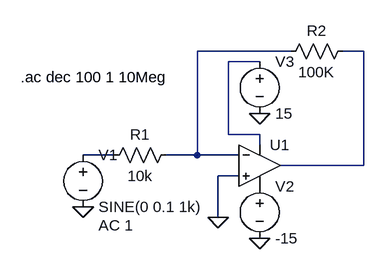
[diagram p0: schematic 00_inverting_amp_smoke_test.asc]
00_inverting_amp_smoke_test.asc, the LTspice schematic file:
Version 4.1
SHEET 1 880 680
WIRE 80 -112 -64 -112
WIRE 192 -112 160 -112
WIRE 32 -96 -16 -96
WIRE -16 16 -16 -96
WIRE 32 16 -16 16
WIRE 32 32 32 16
WIRE -192 48 -240 48
WIRE -64 48 -64 -112
WIRE -64 48 -112 48
WIRE 0 48 -64 48
WIRE 192 64 192 -112
WIRE 192 64 64 64
WIRE 0 80 -32 80
WIRE -32 144 -32 80
FLAG -32 144 0
FLAG -240 128 0
FLAG 32 176 0
FLAG 32 -16 0
SYMBOL OpAmps\\UniversalOpAmp2 32 64 R0
SYMATTR InstName U1
SYMBOL res -96 32 R90
WINDOW 0 0 56 VBottom 2
WINDOW 3 32 56 VTop 2
SYMATTR InstName R1
SYMATTR Value 10k
SYMBOL res 176 -128 R90
WINDOW 0 0 56 VBottom 2
WINDOW 3 32 56 VTop 2
SYMATTR InstName R2
SYMATTR Value 100K
SYMATTR SpiceLine tol=1 pwr=0.1
SYMBOL voltage -240 32 R0
WINDOW 123 24 124 Left 2
WINDOW 39 0 0 Left 0
SYMATTR InstName V1
SYMATTR Value SINE(0 0.1 1k)
SYMATTR Value2 AC 1
SYMBOL voltage 32 80 R0
WINDOW 123 0 0 Left 0
WINDOW 39 0 0 Left 0
SYMATTR InstName V2
SYMATTR Value -15
SYMBOL voltage 32 -112 R0
WINDOW 123 0 0 Left 0
WINDOW 39 0 0 Left 0
SYMATTR InstName V3
SYMATTR Value 15
TEXT -336 -72 Left 2 !.ac dec 100 1 10Meg

The netlist it stands for:
* 00_inverting_amp_smoke_test.asc
X§U1 0 N001 N003 P001 N002 level2 Avol=1Meg GBW=10Meg Slew=10Meg Ilimit=25m Rail=0 Vos=0 En=0 Enk=0 In=0 Ink=0 Rin=500Meg  ; pins In+ In- V+ V- OUT
R1 N001 N004 10k
R2 N002 N001 100K tol=1 pwr=0.1
V1 N004 0 SINE(0 0.1 1k) AC 1
V2 P001 0 -15
V3 N003 0 15
.ac dec 100 1 10Meg
.lib UniversalOpAmp2.lib
.backanno
.end